# EAGLE schematic Schem (EAGLE 7.2.0)
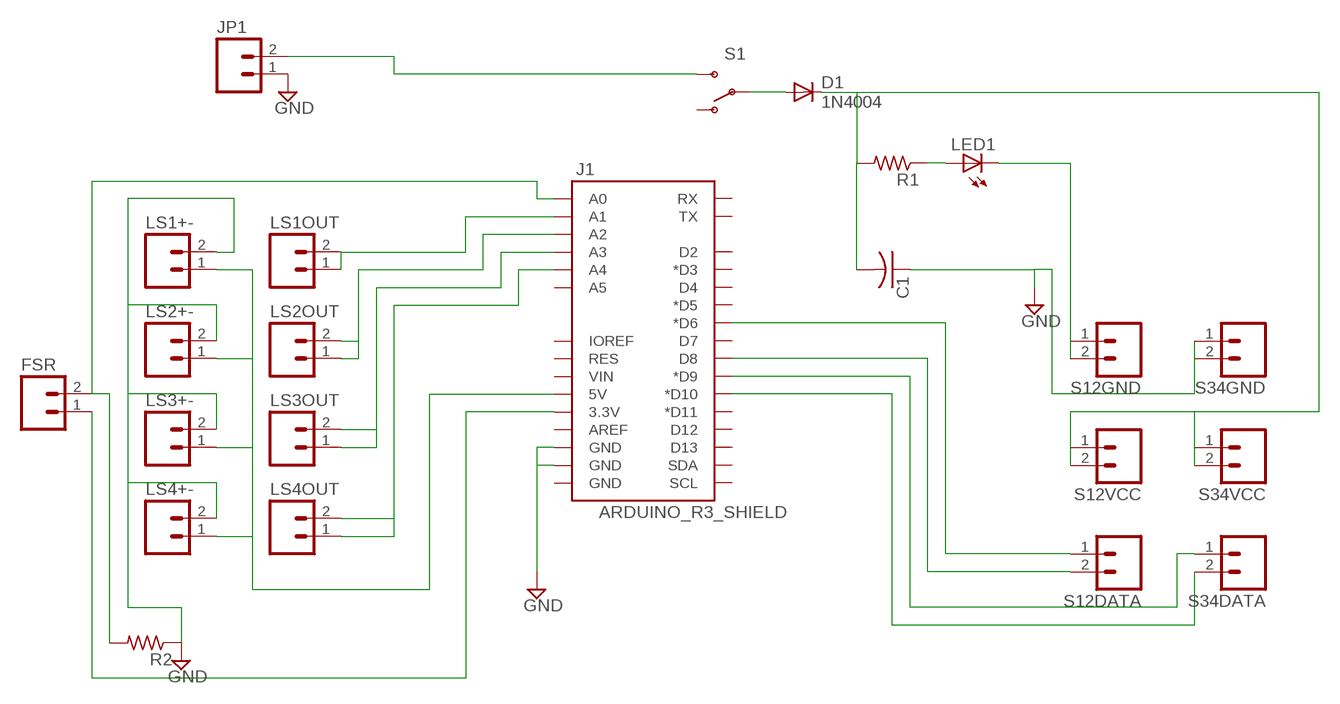
[diagram p0: schematic, sheet 1]

## Parts
C1  C-US075-063X106  [C075-063X106]
D1  1N4004  [DO41-10]
FSR  M02LOCK  [1X02_LOCK]
J1  ARDUINO_R3_SHIELD  [UNO_R3_SHIELD]
JP1  M025MM  [SCREWTERMINAL-5MM-2]
LED1  LED_ELD260  [LED_LD260]
LS1+-  M02LOCK  [1X02_LOCK]
LS1OUT  M02LOCK  [1X02_LOCK]
LS2+-  M02LOCK  [1X02_LOCK]
LS2OUT  M02LOCK  [1X02_LOCK]
LS3+-  M02LOCK  [1X02_LOCK]
LS3OUT  M02LOCK  [1X02_LOCK]
LS4+-  M02LOCK  [1X02_LOCK]
LS4OUT  M02LOCK  [1X02_LOCK]
R1  R-US_0309/10  [0309/10]
R2  R-US_0309/10  [0309/10]
S1  SWITCH-SPDTPTH  [SWITCH-SPDT]
S12DATA  M02LOCK  [1X02_LOCK]
S12GND  M02LOCK  [1X02_LOCK]
S12VCC  M02LOCK  [1X02_LOCK]
S34DATA  M02LOCK  [1X02_LOCK]
S34GND  M02LOCK  [1X02_LOCK]
S34VCC  M02LOCK  [1X02_LOCK]

## Nets
GND: C1.1 J1.GND@1(GND) J1.GND@2(GND) JP1.1 LS1+-.2 LS2+-.2 LS3+-.2 LS4+-.2 R2.1 S34GND.1 S34GND.2
N$1: FSR.1 J1.3.3V
N$3: J1.A2 LS2OUT.1 LS2OUT.2
N$4: J1.A1 LS1OUT.1 LS1OUT.2
N$5: J1.A3 LS3OUT.1 LS3OUT.2
N$6: J1.A4 LS4OUT.1 LS4OUT.2
N$7: C1.2 D1.C R1.2 S12VCC.2 S34VCC.1 S34VCC.2
N$8: J1.5V LS1+-.1 LS2+-.1 LS3+-.1 LS4+-.1
N$9: LED1.A R1.1
N$10: FSR.2 J1.A0 R2.2
N$11: D1.A S1.2(P)
N$12: J1.D6(*D6) S12DATA.1
N$13: JP1.2 S1.3(S)
N$14: J1.D8 S12DATA.2
N$15: J1.D9(*D9) S34DATA.1
N$16: J1.D10(*D10) S34DATA.2
N$17: LED1.K(C) S12GND.1 S12GND.2
Unconnected: J1.A5 J1.AREF J1.D2 J1.D3(*D3) J1.D4 J1.D5(*D5) J1.D7 J1.D11(*D11) J1.D12 J1.D13 J1.GND@0(GND) J1.IOREF J1.RES J1.RX J1.SCL J1.SDA J1.TX J1.VIN S1.1(O) S12VCC.1

## Library data of the parts
C1 = resistor:C-US: CAPACITOR, American symbol
D1 = diode:1N4004: DIODE general purpose rectifier, 1 A
FSR LS1+- LS1OUT LS2+- LS2OUT LS3+- LS3OUT LS4+- LS4OUT S12DATA S12GND S12VCC S34DATA S34GND S34VCC = SparkFun-Connectors:M02: Standard 2-pin 0.1" header. Use with - straight break away headers ( PRT-00116) - right angle break away headers (PRT-00553) - swiss pins (PRT-00743) - machine pins (PRT-00117) - female headers (PRT-00115) Molex polarized connector foot print use with: PRT-08233 with associated crimp pins and housings. 2.54_SCREWTERM for use with PRT-10571. 3.5mm Screw Terminal footprints for PRT-08084 5mm Screw Terminal footprints for use with PRT-08432
J1 = SparkFun-Boards:ARDUINO_R3_SHIELD: Shield form compatible with the Arduino Uno R3.
JP1 = SparkFun-Connectors:M02: Standard 2-pin 0.1" header. Use with - straight break away headers ( PRT-00116) - right angle break away headers (PRT-00553) - swiss pins (PRT-00743) - machine pins (PRT-00117) - female headers (PRT-00115) Molex polarized connector foot print use with: PRT-08233 with associated crimp pins and housings. 2.54_SCREWTERM for use with PRT-10571. 3.5mm Screw Terminal footprints for PRT-08084 5mm Screw Terminal footprints for use with PRT-08432; STOREFRONT_ID: PRT-08432
LED1 = eagle-ltspice:LED_E: LED Source: http://www.osram.convergy.de Source: www.luxeon.com Source: www.kingbright.com; SPICEMODEL: NONE; SPICEPREFIX: D; SPICETYPE: diode
R1 R2 = resistor:R-US_: RESISTOR, American symbol
S1 = SparkFun-Electromechanical:SWITCH-SPDT: SPDT Switch Simple slide switch, Spark Fun Electronics SKU : COM-00102 DPDT SMT slide switch, AYZ0202, SWCH-08179; PROD_ID: SWCH-08261